# Altium schematic sheet Communication Interface.SchDoc
size A4
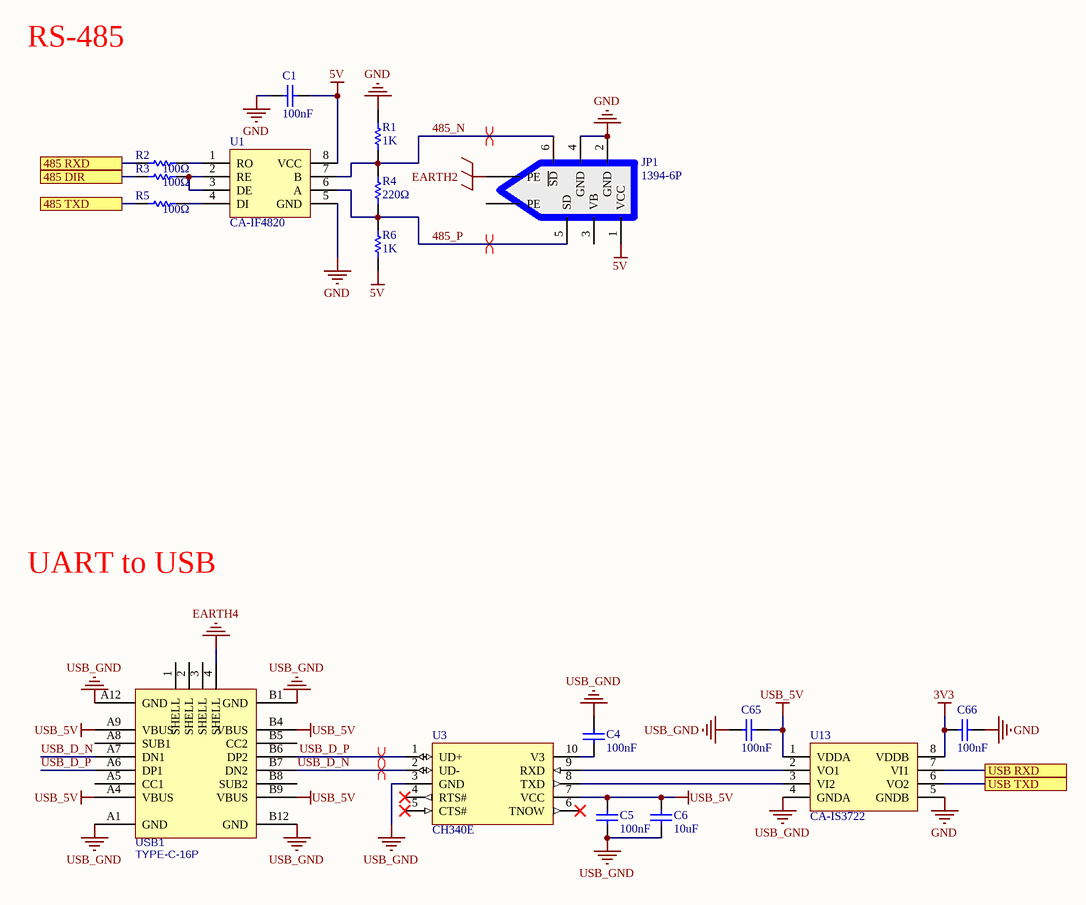
[diagram p0: Communication Interface.SchDoc]

## Parts
C1  100nF  [C0603]
C4  100nF  [C0603]
C5  100nF  [C0603]
C6  10uF  [C0603]
C65  100nF  [C0603]
C66  100nF  [C0603]
JP1  1394-6P  [1394-6P]
R1  1K  [R0603]
R2  100Ω  [R0603]
R3  100Ω  [R0603]
R4  220Ω  [R0603]
R5  100Ω  [R0603]
R6  1K  [R0603]
U1  CA-IF4820  [SOP8_N]
U3  CH340E  [MSOP10]
U13  CA-IS3722  [SOIC8_L W=3.9mm]
USB1  TYPE-C-16P  [USB-C_16P]

## Ports
485 DIR, 485 RXD, 485 TXD, USB RXD, USB TXD

## Nets
3V3: C66.1 U13.8(VDDB)
5V: C1.2 JP1.1(VCC) R6.1 U1.8(VCC)
EARTH2: JP1.7(PE)
EARTH4: USB1.4(SHELL)
GND: C1.1 C66.2 JP1.2(GND) JP1.4(GND) R1.2 U1.5(GND) U13.5(GNDB)
USB_5V: C5.1 C6.1 C65.2 U3.7(VCC) U13.1(VDDA) USB1.A4(VBUS) USB1.A9(VBUS) USB1.B4(VBUS) USB1.B9(VBUS)
USB_GND: C4.2 C5.2 C6.2 C65.1 U3.3(GND) U13.4(GNDA) USB1.A1(GND) USB1.A12(GND) USB1.B1(GND) USB1.B12(GND)
485 DIR: R3.1 ; port 485 DIR
485 RXD: R2.1 ; port 485 RXD
485 TXD: R5.1 ; port 485 TXD
485_N: JP1.6(~{SD}) R1.1 R4.2 U1.7(B)
485_P: JP1.5(SD) R4.1 R6.2 U1.6(A)
USB RXD: U13.7(VI1) ; port USB RXD
USB TXD: U13.6(VO2) ; port USB TXD
USB_D_N: U3.2(UD-) USB1.A7(DN1) USB1.B7(DN2)
USB_D_P: U3.1(UD+) USB1.A6(DP1) USB1.B6(DP2)
NetC4_1: C4.1 U3.10(V3)
NetR2_2: R2.2 U1.1(RO)
NetR3_2: R3.2 U1.2(RE) U1.3(DE)
NetR5_2: R5.2 U1.4(DI)
NetU3_8: U3.8(TXD) U13.3(VI2)
NetU3_9: U3.9(RXD) U13.2(VO1)

Not connected (* = marked no-connect by the designer): JP1 3(VB) 8(PE); U3 4(RTS#)* 5(CTS#)* 6(TNOW)*; USB1 1(SHELL) 2(SHELL) 3(SHELL) A5(CC1) A8(SUB1) B5(CC2) B8(SUB2)

## Layout directives
differential pair: 485_N, 485_P, USB_D_N, USB_D_P

## Notes on the sheet
- RS-485
- UART to USB

## Library data of the parts
C1 C6 = Cap
C4 C5 C65 C66 = Cap_100nF
JP1 = 1394-6P: IEEE 1394 FireWire接口
R1-R6 = RES
U1 = CA-IF4820: 485总线芯片
U3 = CH340E: USB to TTL Serial / UART
U13 = CA-IS3722: 隔离芯片
USB1 = USB-C-16P: BOM_Manufacturer: Shenzhen Kinghelm Elec; BOM_Manufacturer Part: KH-TYPE-C-16P; Contributor: LCSC; BOM_Supplier: LCSC; BOM_Supplier Part: C709357; BOM_JLCPCB Part Class: Extended Part; spicePre: U; spiceSymbolName: KH-TYPE-C-16P